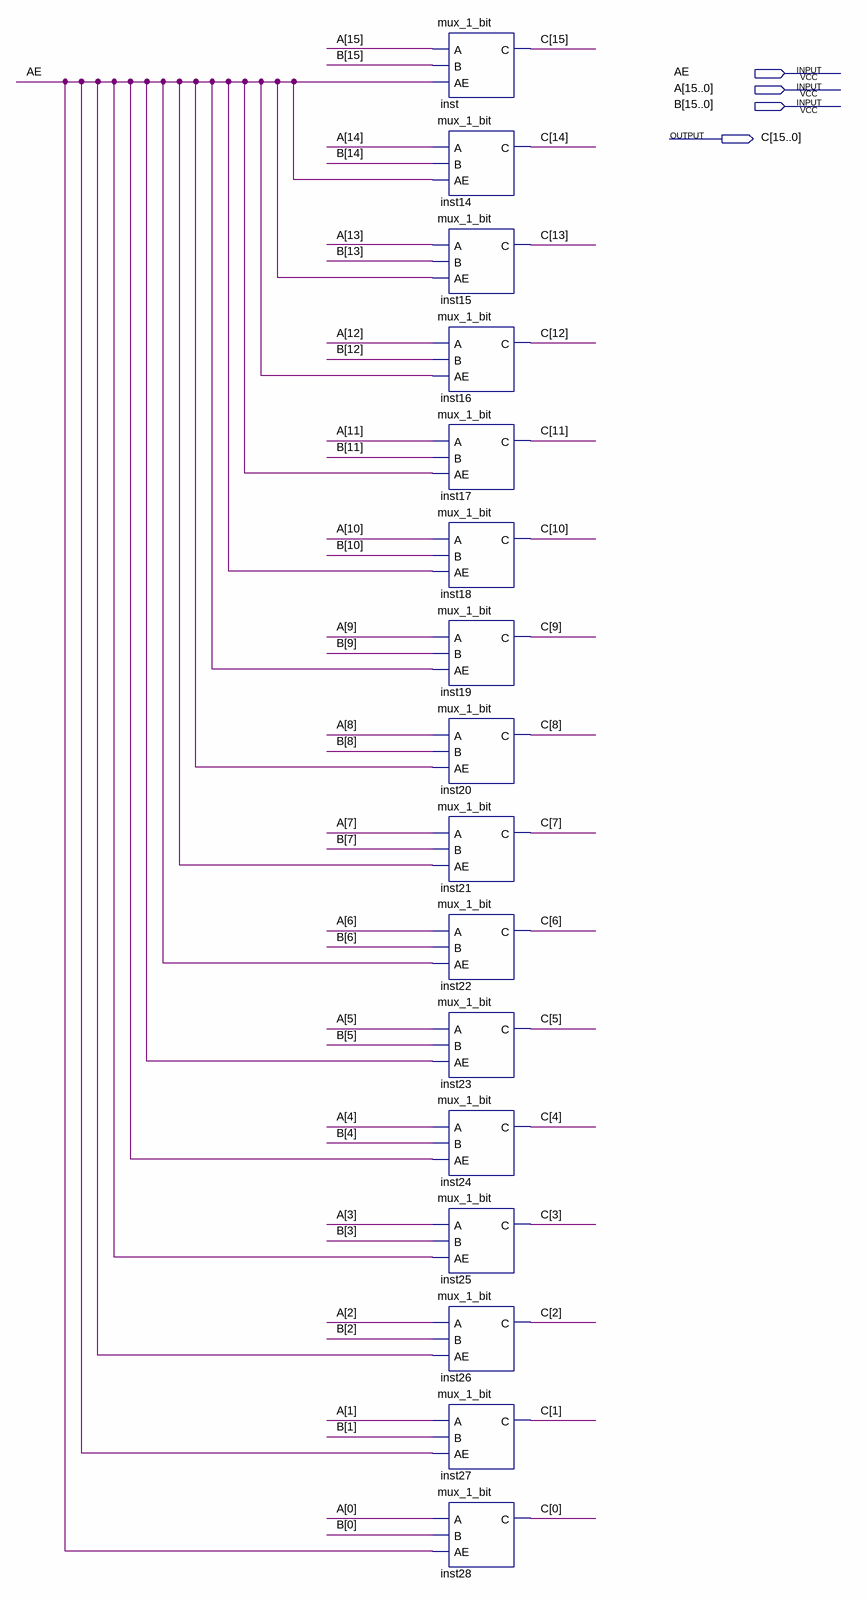
[diagram p0: schematic sheet]
// Quartus schematic mux_16_bits.bdf as structural Verilog: 16 symbols, 4 pins
module mux_16_bits (
  input  AE,
  input  [15:0] A,
  input  [15:0] B,
  output [15:0] C
);

  mux_1_bit inst (.A(A[15]), .B(B[15]), .AE(AE), .C(C[15]));
  mux_1_bit inst14 (.A(A[14]), .B(B[14]), .AE(AE), .C(C[14]));
  mux_1_bit inst15 (.A(A[13]), .B(B[13]), .AE(AE), .C(C[13]));
  mux_1_bit inst16 (.A(A[12]), .B(B[12]), .AE(AE), .C(C[12]));
  mux_1_bit inst17 (.A(A[11]), .B(B[11]), .AE(AE), .C(C[11]));
  mux_1_bit inst18 (.A(A[10]), .B(B[10]), .AE(AE), .C(C[10]));
  mux_1_bit inst19 (.A(A[9]), .B(B[9]), .AE(AE), .C(C[9]));
  mux_1_bit inst20 (.A(A[8]), .B(B[8]), .AE(AE), .C(C[8]));
  mux_1_bit inst21 (.A(A[7]), .B(B[7]), .AE(AE), .C(C[7]));
  mux_1_bit inst22 (.A(A[6]), .B(B[6]), .AE(AE), .C(C[6]));
  mux_1_bit inst23 (.A(A[5]), .B(B[5]), .AE(AE), .C(C[5]));
  mux_1_bit inst24 (.A(A[4]), .B(B[4]), .AE(AE), .C(C[4]));
  mux_1_bit inst25 (.A(A[3]), .B(B[3]), .AE(AE), .C(C[3]));
  mux_1_bit inst26 (.A(A[2]), .B(B[2]), .AE(AE), .C(C[2]));
  mux_1_bit inst27 (.A(A[1]), .B(B[1]), .AE(AE), .C(C[1]));
  mux_1_bit inst28 (.A(A[0]), .B(B[0]), .AE(AE), .C(C[0]));
endmodule
